# Altium schematic sheet Sandeep.SchDoc
size A; SheetNumber: 3; SheetTotal: 6
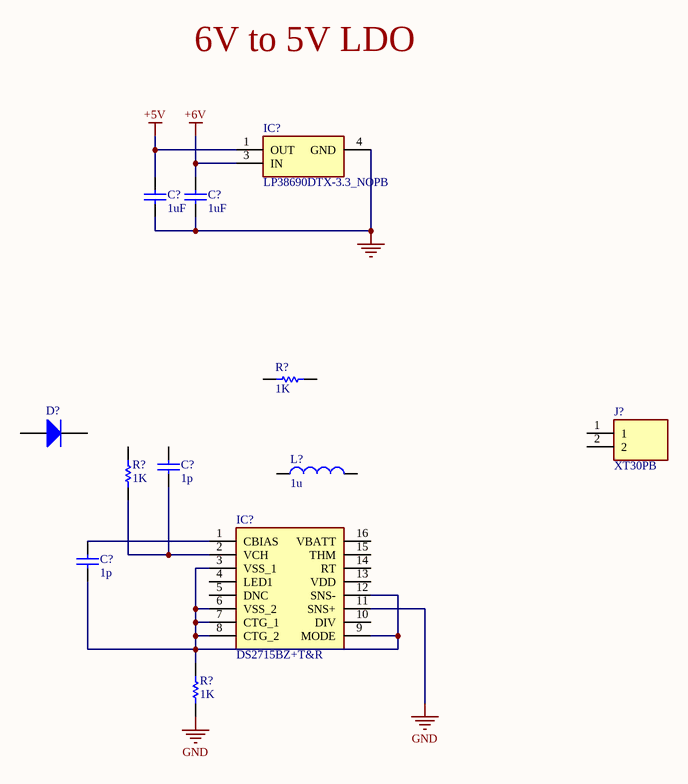
[diagram p0: Sandeep.SchDoc]

## Parts
(Parts that share a designator on the sheet are numbered #1, #2 ... from top to bottom, then left to right.)
C?#1  1uF  [CAPC1608X87X35LL15T15]
C?#2  1uF  [CAPC1608X87X35LL15T15]
C?#3  value 1p  (hidden comment: Capacitor)
C?#4  value 1p  (hidden comment: Capacitor)
D?  Diode  (value not drawn)
IC?#1  LP38690DTX-3.3_NOPB  [LP2950CDTX50NOPB]
IC?#2  DS2715BZ+T&R  [SOIC127P1032X265-16N]
J?  XT30PB  [XT30PB]
L?  value 1u  (hidden comment: Inductor)
R?#1  value 1K  (hidden comment: Resistor)
R?#2  value 1K  (hidden comment: Resistor)
R?#3  value 1K  (hidden comment: Resistor)

## Nets
+5V: C?#1.2 IC?#1.1(OUT)
+6V: C?#2.2 IC?#1.3(IN)
GND: C?#1.1 C?#2.1 IC?#1.4(GND) IC?#2.11(SNS+) R?#3.1
NetC?#3_1: C?#3.1 IC?#2.2(VCH) R?#2.1
NetC?#4_1: C?#4.1 IC?#2.3(VSS_1) IC?#2.6(VSS_2) IC?#2.7(CTG_1) IC?#2.8(CTG_2) IC?#2.9(MODE) IC?#2.12(SNS-) R?#3.2
NetC?#4_2: C?#4.2 IC?#2.1(CBIAS)

Not connected (* = marked no-connect by the designer): C?#3 2; D? 1(A) 2(K); IC?#2 4(LED1) 5(DNC) 10(DIV) 13(VDD) 14(RT) 15(THM) 16(VBATT); J? 1 2; L? 1 2; R?#1 1 2; R?#2 2

## Notes on the sheet
- 6V to 5V LDO

## Library data of the parts
C?#1 C?#2 = CMP-2006-03713-1: Part Number: C0603C105K3RACTU; Manufacturer: Kemet
C?#3 C?#4 = Capacitor: SimulationGenericComponent: True
D? = Diode: AF: 1; BV: 0; BV_MAX: 1e99; EG: 1.11; FC: 0.5; IBV: 0.001; ISR: 1e-14; MJSW: 0.33; NTUN: 30; TNOM: 27; XTI: 3; SimulationGenericComponent: True; CJO: 0; CJP: 0; CTA: 0; CTP: 0; FCS: 0.5; FV_MAX: 1e99; IKF: 0; IKR: 0; JSW: 0; JTUN: 0; JTUNSW: 0; KEG: 1; KF: 0; LEVEL: 1; N: 1; NBV: 1; NR: 1; NS: 1; PHP: 1; RS: 0; TCV: 0; TLEV: 0; TLEVC: 0; TM1: 0; TM2: 0; TPB: 0; TPHP: 0; TRS: 0; TRS2: 0; TT: 0; TTT1: 0; TTT2: 0; VJ: 1; XTITUN: 3; IS: 1e-14
IC?#1 = LP38690DTX-3.3_NOPB: Integrated Circuit; Manufacturer_Name: Texas Instruments; Manufacturer_Part_Number: LP38690DTX-3.3/NOPB; Datasheet Link: http://www.ti.com/lit/gpn/lp38690; Height: 2.55mm; Mouser Part Number: 926-LP38690DTX33NOPB; Mouser Price/Stock: https://www.mouser.co.uk/ProductDetail/Texas-Instruments/LP38690DTX-3.3-NOPB?qs=1FNqv8aZn1TYRyMpXrH3Aw%3D%3D; Arrow Part Number: LP38690DTX-3.3/NOPB; Arrow Price/Stock: https://www.arrow.com/en/products/lp38690dtx-3.3nopb/texas-instruments?region=nac
IC?#2 = DS2715BZ+T&R: Integrated Circuit; Manufacturer_Name: Analog Devices; Datasheet Link: https://www.mouser.in/datasheet/2/256/DS2715-1389140.pdf; Height: 2.65mm; Manufacturer_Part_Number: DS2715BZ+T&R; Mouser Part Number: 700-DS2715BZT&R; Mouser Price/Stock: https://www.mouser.co.uk/ProductDetail/Maxim-Integrated/DS2715BZ%2bTR?qs=LHmEVA8xxfZnvZMuot3c2Q%3D%3D
J? = XT30PB: Connector; Manufacturer_Name: Amass; Datasheet Link: https://www.tme.eu/Document/4acc913878197f8c2e30d4b8cdc47230/XT30UPB%20SPEC.pdf; Height: 10.7mm; Manufacturer_Part_Number: XT30PB
L? = Inductor: SimulationGenericComponent: True
R?#1-R?#3 = Resistor: TC1: 0; SimulationGenericComponent: True; TC2: 0